# EAGLE schematic RS485_HiLowPWM_V1-autoR1 (EAGLE 6.3)
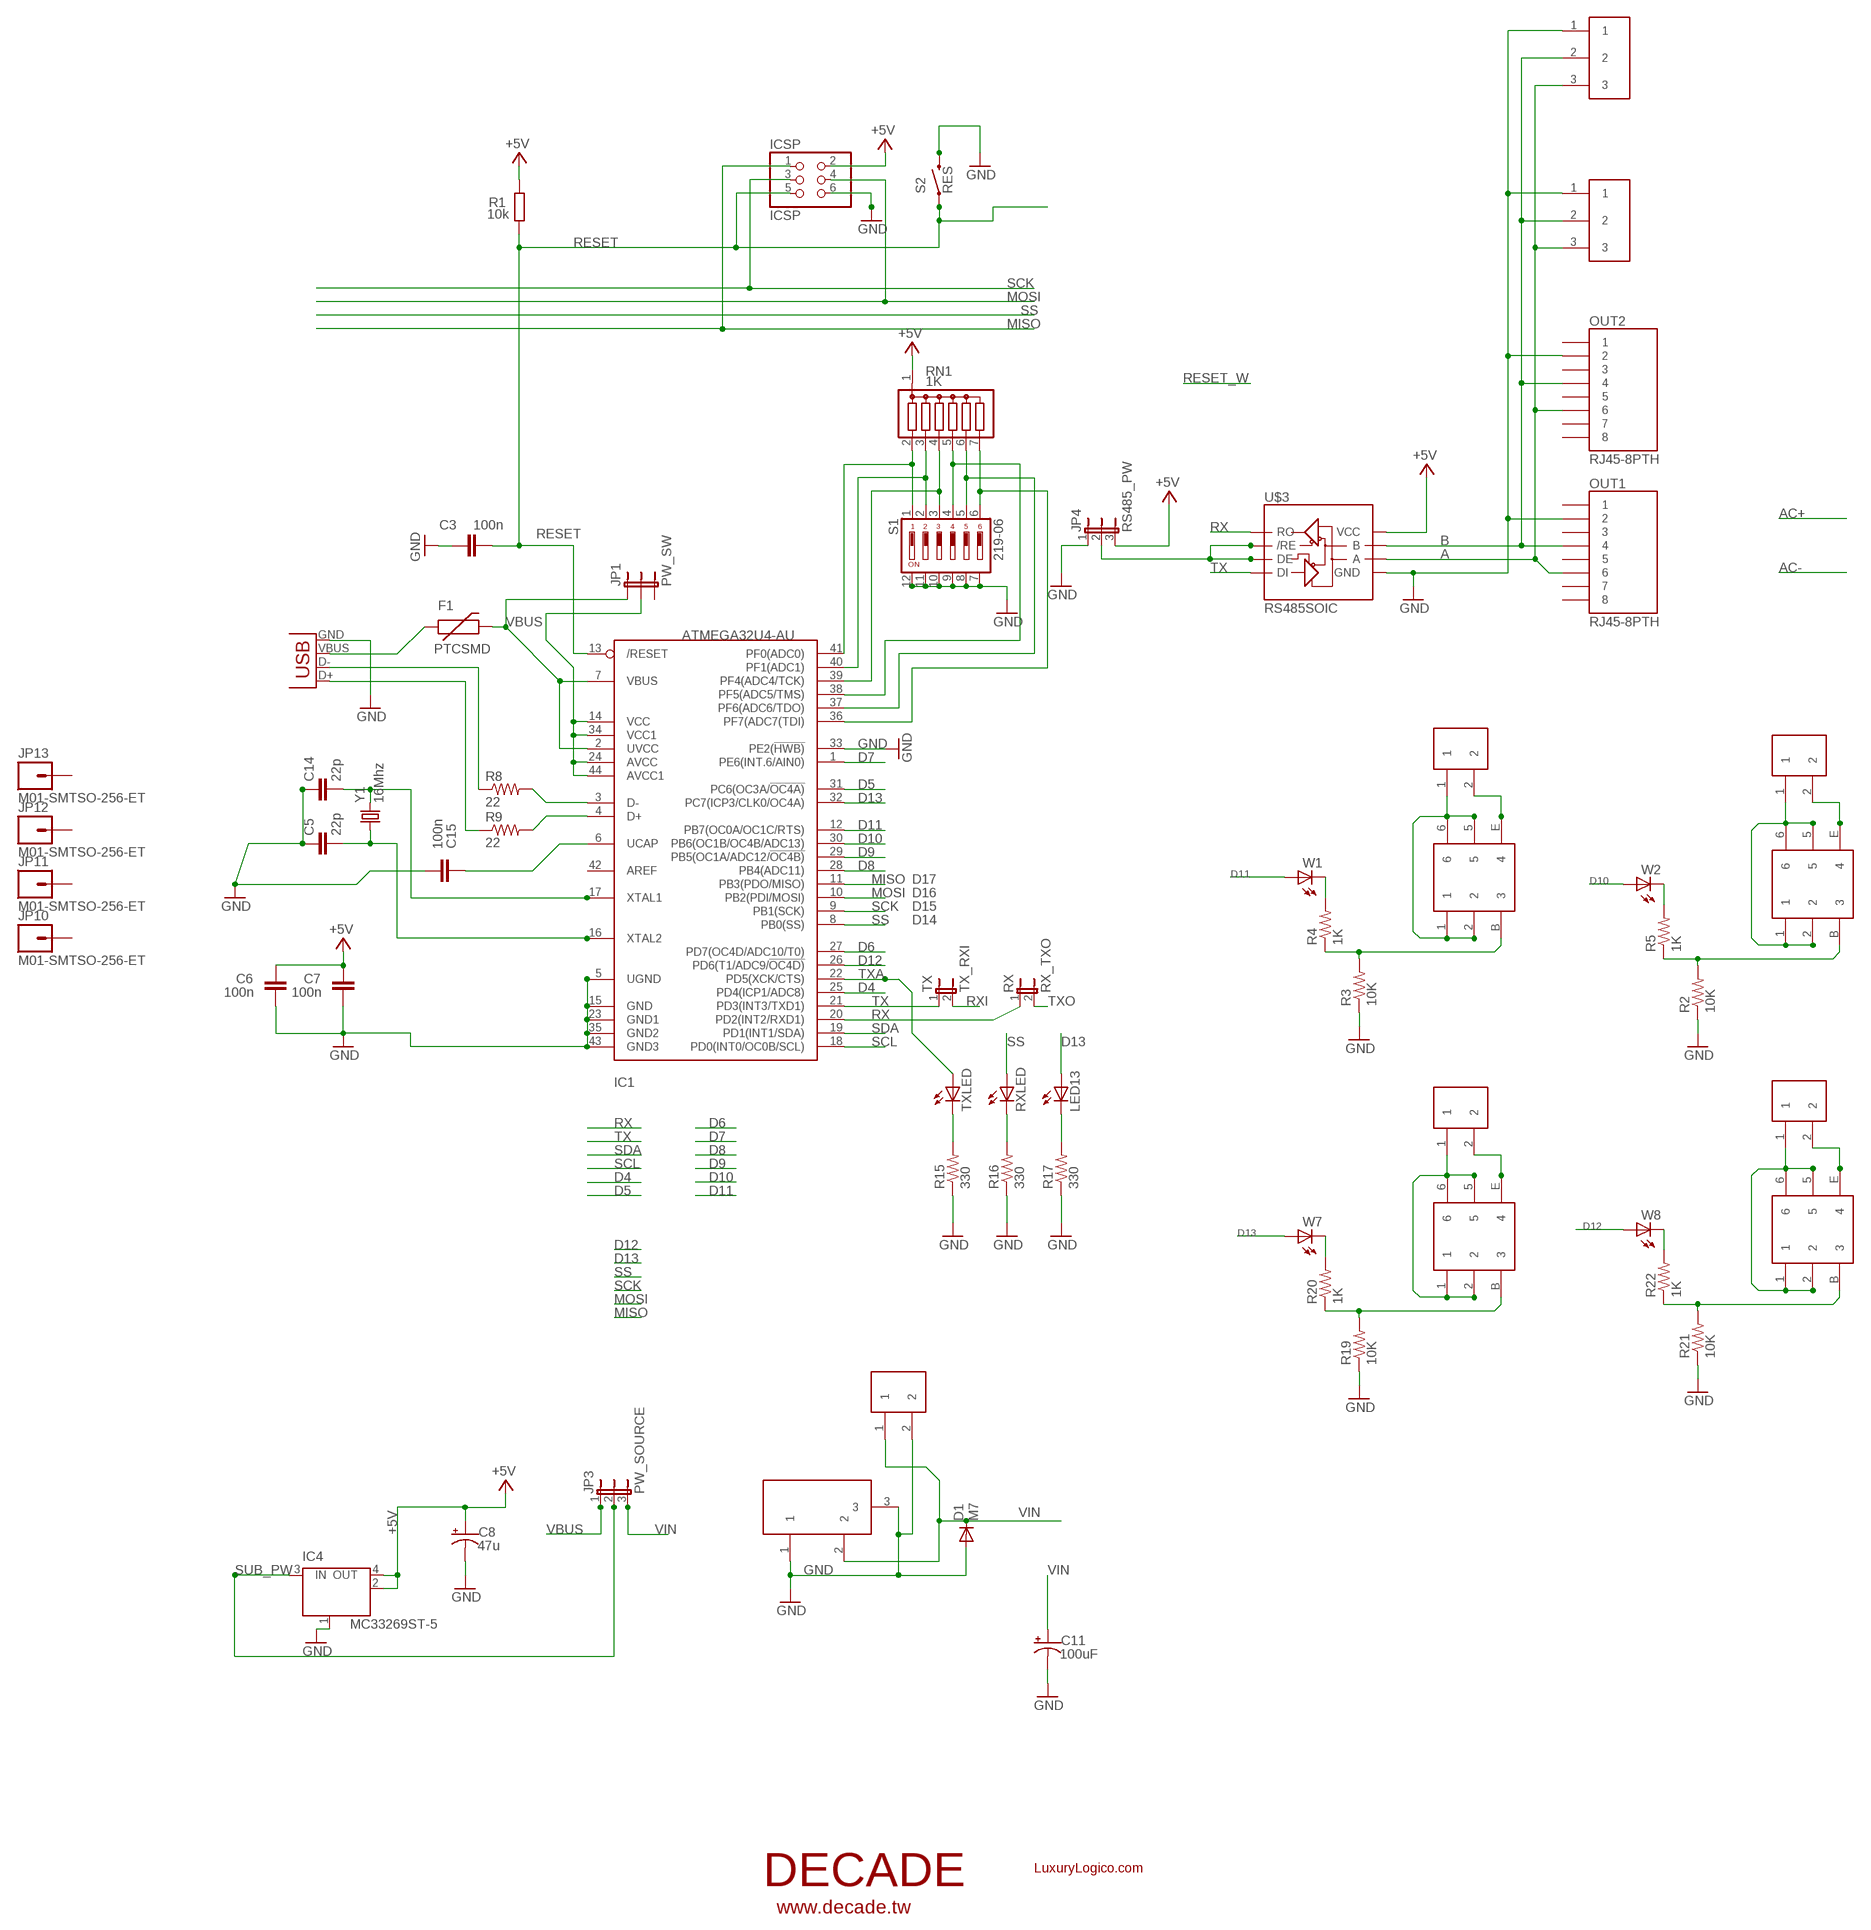
[diagram p0: schematic, sheet 1, part 1 of 2]
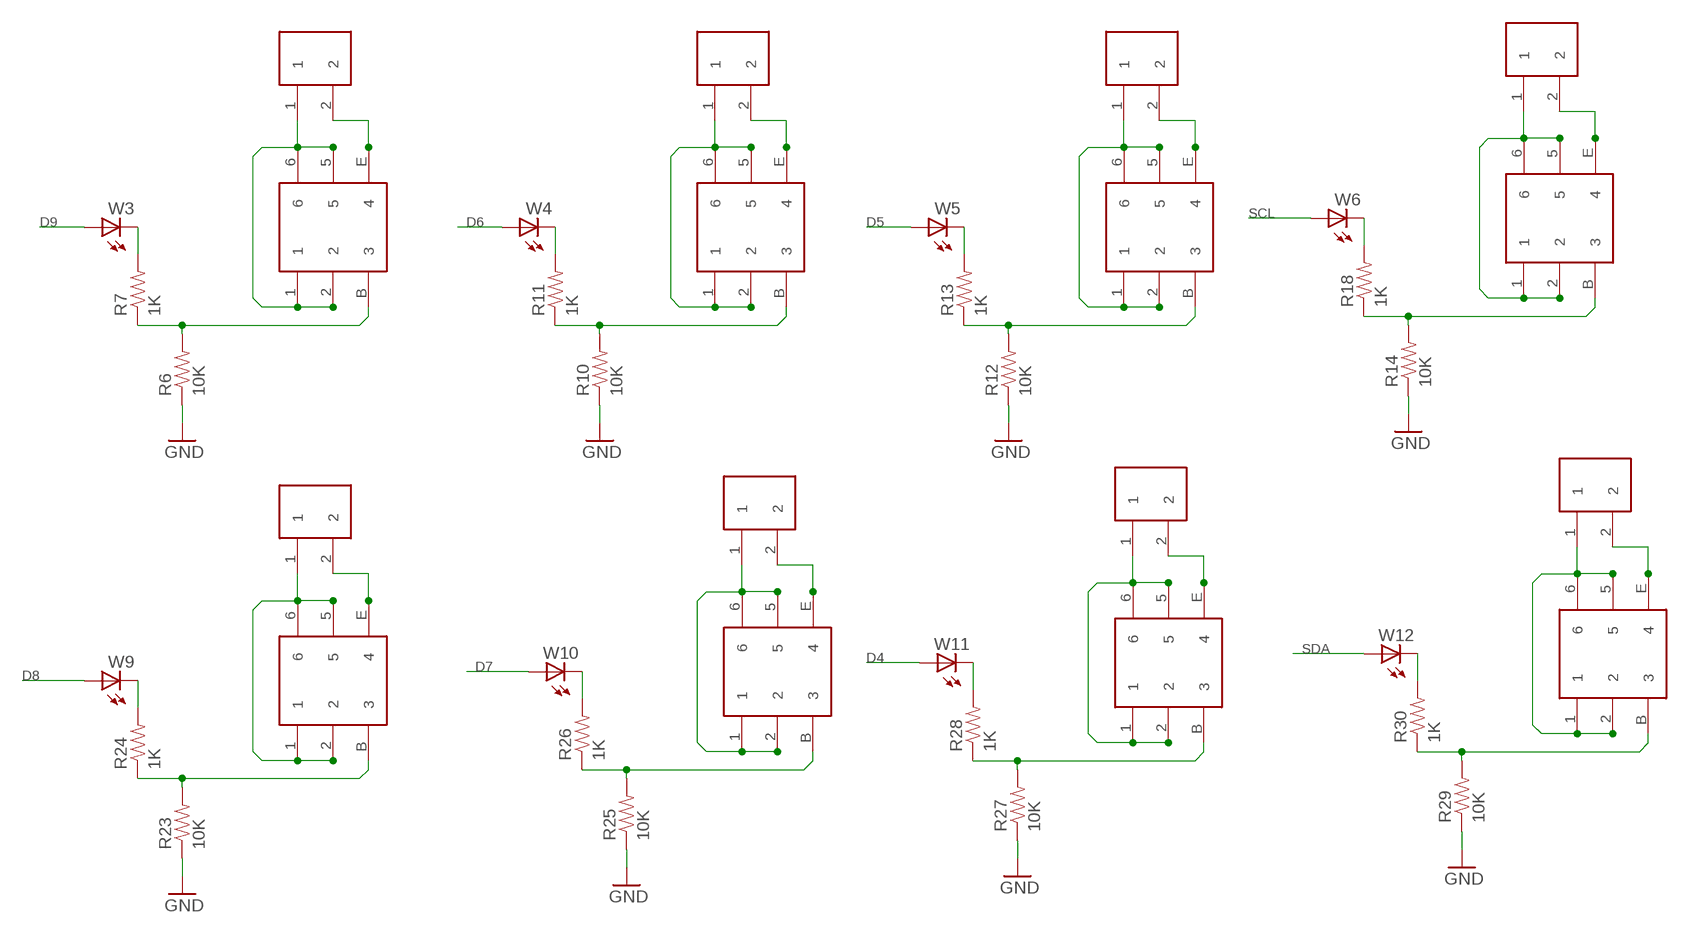
[diagram p1: schematic, sheet 1, part 2 of 2]

## Parts
C3  100n  C-EUC0603  [C0603-ROUND]
C5  22p  CAP0805  [0805]
C6  100n  C-EUC0603  [C0603-ROUND]
C7  100n  C-EUC0603  [C0603-ROUND]
C8  47u  CAP_POLE  [PANASONIC_E]
C11  100uF  CAP_POLE  [PANASONIC_E]
C14  22p  CAP0805  [0805]
C15  100n  C-EUC0603  [C0603-ROUND]
D1  M7  DIODE-SMB  [SMB]
F1  PTCSMD  [PTC-1206]
IC1  ATMEGA32U4-AU  [TQFP44]
IC4  MC33269ST-5  MC33269ST-3.3T3  [SOT223]
ICSP  ICSP  PINHD-2X3  [2X03]
JP1  PW_SW  JUMPER-3SMD  [SJ_3]
JP3  PW_SOURCE  JP2E  [JP2]
JP4  RS485_PW  JP2E  [JP2]
JP10  M01-SMTSO-256-ET  [SMTSO-256-ET]
JP11  M01-SMTSO-256-ET  [SMTSO-256-ET]
JP12  M01-SMTSO-256-ET  [SMTSO-256-ET]
JP13  M01-SMTSO-256-ET  [SMTSO-256-ET]
LED13  LEDCHIPLED_0805  [CHIPLED_0805]
OUT1  RJ45-8PTH  [RJ45-8]
OUT2  RJ45-8PTH  [RJ45-8]
R1  10k  R-EU_0603-RND  [R0603-ROUND]
R2  10K  RESISTOR0805-RES  [0805]
R3  10K  RESISTOR0805-RES  [0805]
R4  1K  RESISTOR0805-RES  [0805]
R5  1K  RESISTOR0805-RES  [0805]
R6  10K  RESISTOR0805-RES  [0805]
R7  1K  RESISTOR0805-RES  [0805]
R8  22  RESISTOR0805-RES  [0805]
R9  22  RESISTOR0805-RES  [0805]
R10  10K  RESISTOR0805-RES  [0805]
R11  1K  RESISTOR0805-RES  [0805]
R12  10K  RESISTOR0805-RES  [0805]
R13  1K  RESISTOR0805-RES  [0805]
R14  10K  RESISTOR0805-RES  [0805]
R15  330  RESISTOR0805-RES  [0805]
R16  330  RESISTOR0805-RES  [0805]
R17  330  RESISTOR0805-RES  [0805]
R18  1K  RESISTOR0805-RES  [0805]
R19  10K  RESISTOR0805-RES  [0805]
R20  1K  RESISTOR0805-RES  [0805]
R21  10K  RESISTOR0805-RES  [0805]
R22  1K  RESISTOR0805-RES  [0805]
R23  10K  RESISTOR0805-RES  [0805]
R24  1K  RESISTOR0805-RES  [0805]
R25  10K  RESISTOR0805-RES  [0805]
R26  1K  RESISTOR0805-RES  [0805]
R27  10K  RESISTOR0805-RES  [0805]
R28  1K  RESISTOR0805-RES  [0805]
R29  10K  RESISTOR0805-RES  [0805]
R30  1K  RESISTOR0805-RES  [0805]
RN1  1K  G06R  [SIL7]
RX  RX_TXO  JP1E  [JP1]
RXLED  LEDCHIPLED_0805  [CHIPLED_0805]
S1  219-06  [CTS-219-06]
S2  RES  SWITCH-MOMENTARY-2-SMD-1101NE  [TACTILE-SWITCH-1101NE]
TX  TX_RXI  JP1E  [JP1]
TXLED  LEDCHIPLED_0805  [CHIPLED_0805]
U$1  DECADE-NSS30201MR6T1G  [DECADE-NSS30201MR6T1G]
U$2  DECADE-5MM-CONN  [DECADE-5MM-CON-1X2]
U$3  RS485SOIC  [SO08]
U$4  DECADE-NSS30201MR6T1G  [DECADE-NSS30201MR6T1G]
U$5  DECADE-5MM-CONN  [DECADE-5MM-CON-1X2]
U$6  DECADE-NSS30201MR6T1G  [DECADE-NSS30201MR6T1G]
U$7  DECADE-5MM-CONN  [DECADE-5MM-CON-1X2]
U$8  DECADE-NSS30201MR6T1G  [DECADE-NSS30201MR6T1G]
U$9  DECADE-5MM-CONN  [DECADE-5MM-CON-1X2]
U$10  DECADE-LOGO-SMALL  [DECADE-LOGO-SMALL]
U$11  DECADE-5MM-CONN  [DECADE-5MM-CON-1X2]
U$12  DECADE-NSS30201MR6T1G  [DECADE-NSS30201MR6T1G]
U$13  DECADE-5MM-CONN  [DECADE-5MM-CON-1X2]
U$14  DECADE-NSS30201MR6T1G  [DECADE-NSS30201MR6T1G]
U$15  DECADE-5MM-CONN  [DECADE-5MM-CON-1X2]
U$16  DECADE-NSS30201MR6T1G  [DECADE-NSS30201MR6T1G]
U$17  DECADE-5MM-CONN  [DECADE-5MM-CON-1X2]
U$18  DECADE-NSS30201MR6T1G  [DECADE-NSS30201MR6T1G]
U$19  DECADE-5MM-CONN  [DECADE-5MM-CON-1X2]
U$20  DECADE-NSS30201MR6T1G  [DECADE-NSS30201MR6T1G]
U$21  DECADE-5MM-CONN  [DECADE-5MM-CON-1X2]
U$22  DECADE-NSS30201MR6T1G  [DECADE-NSS30201MR6T1G]
U$23  DECADE-5MM-CONN  [DECADE-5MM-CON-1X2]
U$24  DECADE-NSS30201MR6T1G  [DECADE-NSS30201MR6T1G]
U$25  DECADE-5MM-CONN  [DECADE-5MM-CON-1X2]
U$26  DECADE-NSS30201MR6T1G  [DECADE-NSS30201MR6T1G]
U$27  DECADE-5MM-CONN  [DECADE-5MM-CON-1X2]
U$28  DECADE-5MM-CON-1X3  [DECADE-5MM-CON-1X3]
U$29  DECADE-5MM-CON-1X3  [DECADE-5MM-CON-1X3]
U$30  LL-LUXURYLOGICO.COM  [DECADE-LL-LOGO-SMALL]
W1  LEDCHIPLED_0805  [CHIPLED_0805]
W2  LEDCHIPLED_0805  [CHIPLED_0805]
W3  LEDCHIPLED_0805  [CHIPLED_0805]
W4  LEDCHIPLED_0805  [CHIPLED_0805]
W5  LEDCHIPLED_0805  [CHIPLED_0805]
W6  LEDCHIPLED_0805  [CHIPLED_0805]
W7  LEDCHIPLED_0805  [CHIPLED_0805]
W8  LEDCHIPLED_0805  [CHIPLED_0805]
W9  LEDCHIPLED_0805  [CHIPLED_0805]
W10  LEDCHIPLED_0805  [CHIPLED_0805]
W11  LEDCHIPLED_0805  [CHIPLED_0805]
W12  LEDCHIPLED_0805  [CHIPLED_0805]
X1  DC21MMX  [DC-21MM]
X3  USBOLD  [USB-MINIB-OLD]
Y1  16Mhz  CRYSTAL5X3  [CRYSTAL-SMD-5X3]

## Nets
+5V [power]: C6.1 C7.1 C8.+ IC4.2(OUT) IC4.4(OUT) ICSP.2 JP4.3 R1.2 RN1.1 U$3.8(VCC)
A: OUT1.6 OUT2.6 U$3.6(A) U$28.3 U$29.3
B: OUT1.4 OUT2.4 U$3.7(B) U$28.2 U$29.2
D4: IC1.25(PD4(ICP1/ADC8)) W11.A
D5: IC1.31(PC6(OC3A/!OC4A)) W5.A
D6: IC1.27(PD7(OC4D/ADC10/T0)) W4.A
D7: IC1.1(PE6(INT.6/AIN0)) W10.A
D8: IC1.28(PB4(ADC11)) W9.A
D9: IC1.29(PB5(OC1A/ADC12/!OC4B)) W3.A
D10: IC1.30(PB6(OC1B/OC4B/ADC13)) W2.A
D11: IC1.12(PB7(OC0A/OC1C/RTS)) W1.A
D12: IC1.26(PD6(T1/ADC9/!OC4D)) W8.A
D13: IC1.32(PC7(ICP3/CLK0/OC4A)) LED13.A W7.A
GND [power]: C3.2 C5.1 C6.2 C7.2 C8.- C11.- C14.1 C15.2 D1.A IC1.5(UGND) IC1.15(GND) IC1.23(GND1) IC1.33(PE2(!HWB)) IC1.35(GND2) IC1.43(GND3) IC4.1(GND/ADJ) ICSP.6 JP4.1 OUT1.2 OUT2.2 R2.1 R3.1 R6.1 R10.1 R12.1 R14.1 R15.1 R16.1 R17.1 R19.1 R21.1 R23.1 R25.1 R27.1 R29.1 S1.7 S1.8 S1.9 S1.10 S1.11 S1.12 S2.P$2 U$3.5(GND) U$9.2 U$28.1 U$29.1 X1.1 X1.3 X3.GND
MISO: IC1.11(PB3(PDO/MISO)) ICSP.1
MOSI: IC1.10(PB2(PDI/MOSI)) ICSP.4
N$1: U$1.1 U$1.2 U$1.5 U$1.6 U$2.1
N$2: R4.2 W1.C
N$3: U$1.E U$2.2
N$4: R5.2 W2.C
N$5: R3.2 R4.1 U$1.B
N$6: C5.2 IC1.16(XTAL2) Y1.1
N$7: C14.2 IC1.17(XTAL1) Y1.3
N$8: R2.2 R5.1 U$4.B
N$9: U$4.1 U$4.2 U$4.5 U$4.6 U$5.1
N$10: U$4.E U$5.2
N$11: IC1.3(D-) R8.2
N$12: IC1.4(D+) R9.2
N$13: R8.1 X3.D-
N$14: R9.1 X3.D+
N$15: F1.1 X3.VBUS
N$16: R15.2 TXLED.C
N$17: R7.2 W3.C
N$18: C15.1 IC1.6(UCAP)
N$19: IC1.14(VCC) IC1.24(AVCC) IC1.34(VCC1) IC1.44(AVCC1) JP1.2
N$20: R6.2 R7.1 U$6.B
N$21: JP4.2 U$3.2(/RE) U$3.3(DE)
N$22: U$6.1 U$6.2 U$6.5 U$6.6 U$7.1
N$23: U$6.E U$7.2
N$24: R11.2 W4.C
N$25: R10.2 R11.1 U$8.B
N$26: U$8.1 U$8.2 U$8.5 U$8.6 U$11.1
N$27: U$8.E U$11.2
N$28: R13.2 W5.C
N$29: R12.2 R13.1 U$12.B
N$30: U$12.1 U$12.2 U$12.5 U$12.6 U$13.1
N$31: U$12.E U$13.2
N$32: R18.2 W6.C
N$33: R14.2 R18.1 U$14.B
N$34: U$14.1 U$14.2 U$14.5 U$14.6 U$15.1
N$35: U$14.E U$15.2
N$36: R20.2 W7.C
N$37: R16.2 RXLED.C
N$38: LED13.C R17.2
N$39: R19.2 R20.1 U$16.B
N$40: IC1.41(PF0(ADC0)) RN1.2 S1.1
N$41: IC1.40(PF1(ADC1)) RN1.3 S1.2
N$42: IC1.39(PF4(ADC4/TCK)) RN1.4 S1.3
N$43: IC1.38(PF5(ADC5/TMS)) RN1.5 S1.4
N$44: IC1.37(PF6(ADC6/TDO)) RN1.6 S1.5
N$45: IC1.36(PF7(ADC7(TDI)) RN1.7 S1.6
N$46: U$16.1 U$16.2 U$16.5 U$16.6 U$17.1
N$47: U$16.E U$17.2
N$48: R22.2 W8.C
N$49: R21.2 R22.1 U$18.B
N$50: U$18.1 U$18.2 U$18.5 U$18.6 U$19.1
N$51: U$18.E U$19.2
N$52: R24.2 W9.C
N$53: R23.2 R24.1 U$20.B
N$54: U$20.1 U$20.2 U$20.5 U$20.6 U$21.1
N$55: U$20.E U$21.2
N$56: R26.2 W10.C
N$57: R25.2 R26.1 U$22.B
N$58: U$22.1 U$22.2 U$22.5 U$22.6 U$23.1
N$59: U$22.E U$23.2
N$60: R28.2 W11.C
N$61: R27.2 R28.1 U$24.B
N$62: U$24.1 U$24.2 U$24.5 U$24.6 U$25.1
N$63: U$24.E U$25.2
N$64: R30.2 W12.C
N$65: R29.2 R30.1 U$26.B
N$66: U$26.1 U$26.2 U$26.5 U$26.6 U$27.1
N$67: U$26.E U$27.2
RESET: C3.1 IC1.13(/RESET) ICSP.5 R1.1 S2.P$1
RX: IC1.20(PD2(INT2/RXD1)) RX.1 U$3.1(RO)
RXI: TX.2
SCK: IC1.9(PB1(SCK)) ICSP.3
SCL: IC1.18(PD0(INT0/OC0B/SCL)) W6.A
SDA: IC1.19(PD1(INT1/SDA)) W12.A
SS: IC1.8(PB0(SS)) RXLED.A
SUB_PW [VIN]: IC4.3(IN) JP3.2
TX: IC1.21(PD3(INT3/TXD1)) TX.1 U$3.4(DI)
TXA: IC1.22(PD5(XCK/CTS)) TXLED.A
TXO: RX.2
VBUS: F1.2 IC1.2(UVCC) IC1.7(VBUS) JP1.1 JP3.1
VIN [VIN]: C11.+ D1.C JP3.3 U$9.1 X1.2
Unconnected: IC1.42(AREF) JP1.3 JP10.P$1 JP11.P$1 JP12.P$1 JP13.P$1 OUT1.1 OUT1.3 OUT1.5 OUT1.7 OUT1.8 OUT2.1 OUT2.3 OUT2.5 OUT2.7 OUT2.8

## Notes on the sheet
- D17
- D16
- D15
- D14

## Library data of the parts
C3 C6 C7 C15 = SmartPrj:C-EU: CAPACITOR, European symbol
C5 C14 = SparkFun-Passives:CAP: Capacitor Standard 0603 ceramic capacitor, and 0.1" leaded capacitor.
C8 C11 = SparkFun-Passives:CAP_POL: Capacitor Polarized These are standard SMD and PTH capacitors. Normally 10uF, 47uF, and 100uF in electrolytic and tantalum varieties. Always verify the external diameter of the through hole cap, it varies with capacity, voltage, and manufacturer. The EIA devices should be standard.
D1 = diode:DIODE-: DIODE
F1 = SparkFun-PowerIC:PTC: Resettable Fuse PTC Resettable Fuse. Spark Fun Electronics SKU : COM-08357
IC1 = adafruit:ATMEGA32U4: http://www.ladyada.net/library/eagle
IC4 = linear:MC33269ST*: Adjustable Output Low Dropout Voltage Regulator 800 mA Source: http://www.onsemi.com/pub/Collateral/MC33269-D.PDF
ICSP = pinhead:PINHD-2X3: PIN HEADER
JP1 = SparkFun-Passives:JUMPER-3
JP3 JP4 = jumper:JP2E: JUMPER
JP10-JP13 = SparkFun-Connectors:M01: Header 1 Standard 1-pin 0.1" header. Use with straight break away headers (SKU : PRT-00116), right angle break away headers (PRT-00553), swiss pins (PRT-00743), machine pins (PRT-00117), and female headers (PRT-00115).
LED13 RXLED TXLED W1-W12 = led:LED: LED OSRAM: - CHIPLED LG R971, LG N971, LY N971, LG Q971, LY Q971, LO R971, LY R971 LH N974, LH R974 LS Q976, LO Q976, LY Q976 LO Q996 - Hyper CHIPLED LW Q18S LB Q993, LB Q99A, LB R99A - SideLED LS A670, LO A670, LY A670, LG A670, LP A670 LB A673, LV A673, LT A673, LW A673 LH A674 LY A675 LS A676, LA A676, LO A676, LY A676, LW A676 LS A679, LY A679, LG A679 - Hyper Micro SIDELED® LS Y876, LA Y876, LO Y876, LY Y876 LT Y87S - SmartLED LW L88C, LW L88S LB L89C, LB L89S, LG L890 LS L89K, LO L89K, LY L89K LS L896, LA L896, LO L896, LY L896 - TOPLED LS T670, LO T670, LY T670, LG T670, LP T670 LSG T670, LSP T670, LSY T670, LOP T670, LYG T670 LG T671, LOG T671, LSG T671 LB T673, LV T673, LT T673, LW T673 LH T674 LS T676, LA T676, LO T676, LY T676, LB T676, LH T676, LSB T676, LW T676 LB T67C, LV T67C, LT T67C, LS T67K, LO T67K, LY T67K, LW E67C LS E67B, LA E67B, LO E67B, LY E67B, LB E67C, LV E67C, LT E67C LW T67C LS T679, LY T679, LG T679 LS T770, LO T770, LY T770, LG T770, LP T770 LB T773, LV T773, LT T773, LW T773 LH T774 LS E675, LA E675, LY E675, LS T675 LS T776, LA T776, LO T776, LY T776, LB T776 LHGB T686 LT T68C, LB T68C - Hyper Mini TOPLED® LB M676 - Mini TOPLED Santana® LG M470 LS M47K, LO M47K, LY M47K Source: http://www.osram.convergy.de LUXEON: - LUMILED® LXK2-PW12-R00, LXK2-PW12-S00, LXK2-PW14-U00, LXK2-PW14-V00 LXK2-PM12-R00, LXK2-PM12-S00, LXK2-PM14-U00 LXK2-PE12-Q00, LXK2-PE12-R00, LXK2-PE12-S00, LXK2-PE14-T00, LXK2-PE14-U00 LXK2-PB12-K00, LXK2-PB12-L00, LXK2-PB12-M00, LXK2-PB14-N00, LXK2-PB14-P00, LXK2-PB14-Q00 LXK2-PR12-L00, LXK2-PR12-M00, LXK2-PR14-Q00, LXK2-PR14-R00 LXK2-PD12-Q00, LXK2-PD12-R00, LXK2-PD12-S00 LXK2-PH12-R00, LXK2-PH12-S00 LXK2-PL12-P00, LXK2-PL12-Q00, LXK2-PL12-R00 Source: www.luxeon.com KINGBRIGHT: KA-3528ASYC Source: www.kingbright.com
OUT1 OUT2 = SparkFun-Connectors:RJ45-8: RJ45 Jack Simple RJ45, 8-pin connection - connector for common Cat5, Cat5e, and Cat6 Ethernet cables. Footprint not yet proven in production. Connector sku is PRT-00643; Breakout PCB sku is BOB-00716.
R1 = SmartPrj:R-EU_: RESISTOR, European symbol
R2 R3 R6 R10 R12 R14 R19 R21 R23 R25 R27 R29 = SparkFun-Resistors:RESISTOR: Resistor Basic schematic elements and footprints for 0603, 1206, and PTH resistors.
R4 R5 R7-R9 R11 R13 R15-R18 R20 R22 R24 R26 R28 R30 = SparkFun-Passives:RESISTOR: Resistor Basic schematic elements and footprints for 0603, 1206, and PTH resistors.
RN1 = resistor-sil:G06R: SIL RESISTOR; OC_FARNELL: unknown; OC_NEWARK: unknown
RX TX = jumper:JP1E: JUMPER
S1 = switch-dil:219-06*: Surface Mount DIP Switch Series 219 SMT CTS Electronic Components Sourc: www.ctscorp.com; OC_FARNELL: unknown; OC_NEWARK: unknown
S2 = SparkFun-Electromechanical:SWITCH-MOMENTARY-2: Various NO switches- pushbuttons, reed, etc
U$1 U$4 U$6 U$8 U$12 U$14 U$16 U$18 U$20 U$22 U$24 U$26 = DECADE-libraries:DECADE-NSS30201MR6T1G
U$2 U$5 U$7 U$9 U$11 U$13 U$15 U$17 U$19 U$21 U$23 U$25 U$27 = DECADE-libraries:DECADE-5MM-CONN
U$3 = SparkFun-DigitalIC:RS485: RS485 transceiver
U$10 = DECADE-libraries:DECADE-LOGO-SMALL
U$28 U$29 = DECADE-libraries:DECADE-5MM-CON-1X3
U$30 = DECADE-libraries:LL-LUXURYLOGICO.COM
X1 = powersupply:DC21MM
X3 = SparkFun-Connectors:USB: USB Connectors USB-B-PTH is fully proven SKU : PRT-00139 USB-miniB is fully proven SKU : PRT-00587 USB-A-PCB is untested. USB-A-H is throughly reviewed, but untested. Spark Fun Electronics SKU : PRT-00437 USB-B-SMT is throughly reviewed, but untested. Needs silkscreen touching up. USB-A-S has not been used/tested USB-MB-H has not been used/tested
Y1 = SparkFun-FreqCtrl:CRYSTAL: Various standard crystals. Proven footprints. Spark Fun Electronics SKU : COM-00534

## Net classes
0 default: width 0.152 mm, drill 0.152 mm, clearance 0.152 mm
1 power: width 0.152 mm, drill 0.152 mm, clearance 0.152 mm
2 VIN: width 0.152 mm, drill 0.152 mm, clearance 0.305 mm